# Altium schematic sheet MCU.SchDoc
size A4; SheetNumber: 2; SheetTotal: 4
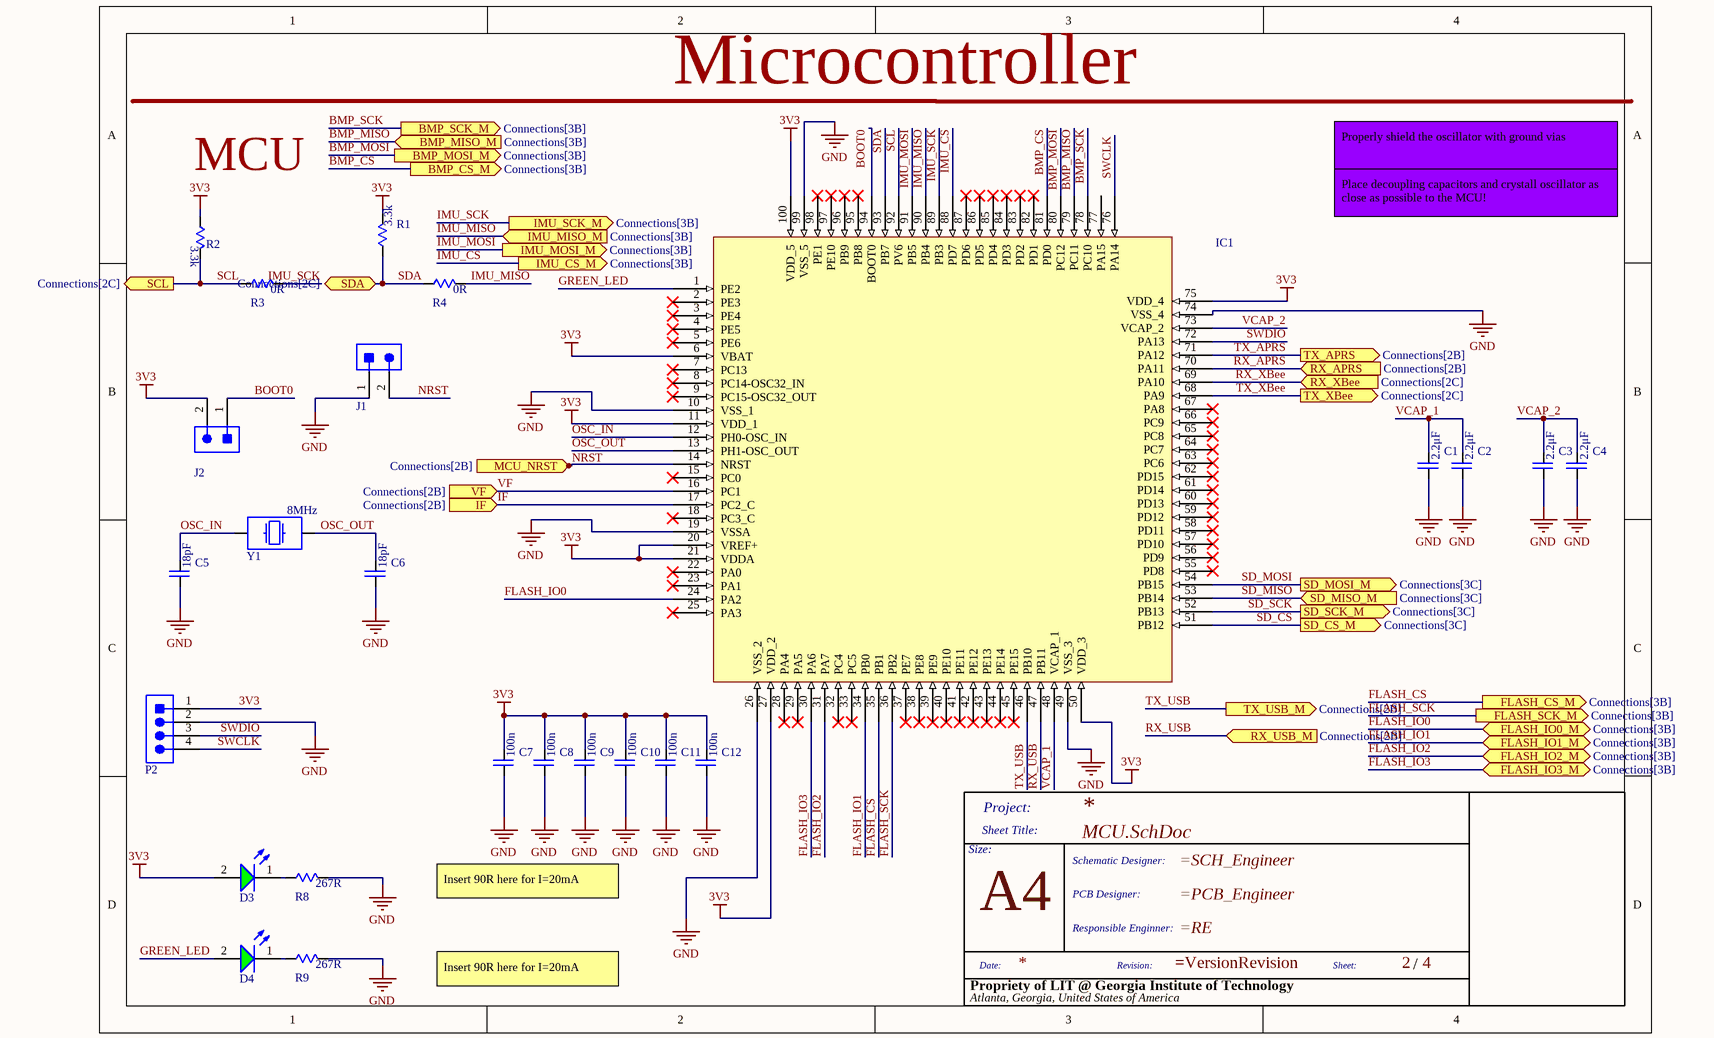
[diagram p0: MCU.SchDoc]

## Parts
*  Size: A4  (hidden comment: TitleBlock)  (graphical)
C1  CL10A225KO8NNNC  [0603-CAP]  (value not drawn)
C2  CL10A225KO8NNNC  [0603-CAP]  (value not drawn)
C3  CL10A225KO8NNNC  [0603-CAP]  (value not drawn)
C4  CL10A225KO8NNNC  [0603-CAP]  (value not drawn)
C5  600F180FT250XT  [CAP-0805]  (value not drawn)
C6  600F180FT250XT  [CAP-0805]  (value not drawn)
C7  KGM21NR71E104KT  [CAP-0805]  (value not drawn)
C8  KGM21NR71E104KT  [CAP-0805]  (value not drawn)
C9  KGM21NR71E104KT  [CAP-0805]  (value not drawn)
C10  KGM21NR71E104KT  [CAP-0805]  (value not drawn)
C11  KGM21NR71E104KT  [CAP-0805]  (value not drawn)
C12  KGM21NR71E104KT  [CAP-0805]  (value not drawn)
D3  LTST-C190KGKT  [FP-LTST-C190KGKT-MFG]  (value not drawn)
D4  LTST-C190KGKT  [FP-LTST-C190KGKT-MFG]  (value not drawn)
IC1  STM32H723VGT6  [QFP50P1600X1600X160-100N]  (value not drawn)
J1  61300211121  [HEADER-2-Pin]  (value not drawn)
J2  61300211121  [HEADER-2-Pin]  (value not drawn)
P2  22-27-2041  [MOLX-22-27-2041_V]  (value not drawn)
R1  ERA-3AEB332V  [0603-RES]  (value not drawn)
R2  ERA-3AEB332V  [0603-RES]  (value not drawn)
R3  ERJ-6GEY0R00V  [0805-RES]  (value not drawn)
R4  ERJ-6GEY0R00V  [0805-RES]  (value not drawn)
R8  ERJ-3EKF2670V  [0603-RES]  (value not drawn)
R9  ERJ-3EKF2670V  [0603-RES]  (value not drawn)
Y1  ABLS-8.000MHZ-B2-T  [ABLS-8.000MHZ-B2-T]  (value not drawn)

## Ports
BMP_CS_M (out, see Connections[3B]), BMP_MISO_M (in, see Connections[3B]), BMP_MOSI_M (out, see Connections[3B]), BMP_SCK_M (out, see Connections[3B]), FLASH_CS_M (out, see Connections[3B]), FLASH_IO0_M (bidir, see Connections[3B]), FLASH_IO1_M (bidir, see Connections[3B]), FLASH_IO2_M (bidir, see Connections[3B]), FLASH_IO3_M (bidir, see Connections[3B]), FLASH_SCK_M (out, see Connections[3B]), IF (in, see Connections[2B]), IMU_CS_M (out, see Connections[3B]), IMU_MISO_M (in, see Connections[3B]), IMU_MOSI_M (out, see Connections[3B]), IMU_SCK_M (out, see Connections[3B]), MCU_NRST (in, see Connections[2B]), RX_APRS (in, see Connections[2B]), RX_USB_M (in, see Connections[2B]), RX_XBee (in, see Connections[2C]), SCL (out, see Connections[2C]), SD_CS_M (out, see Connections[3C]), SD_MISO_M (in, see Connections[3C]), SD_MOSI_M (out, see Connections[3C]), SD_SCK_M (out, see Connections[3C]), SDA (bidir, see Connections[2C]), TX_APRS (out, see Connections[2B]), TX_USB_M (out, see Connections[2B]), TX_XBee (out, see Connections[2C]), VF (in, see Connections[2B])

## Nets
3V3: C7.2 C8.2 C9.2 C10.2 C11.2 C12.2 D3.2(A) IC1.6(VBAT) IC1.11(VDD_1) IC1.20(VREF+) IC1.21(VDDA) IC1.27(VDD_2) IC1.50(VDD_3) IC1.75(VDD_4) IC1.100(VDD_5) J2.2 P2.1 R1.2 R2.1
GND: C1.1 C2.1 C3.1 C4.1 C5.1 C6.1 C7.1 C8.1 C9.1 C10.1 C11.1 C12.1 IC1.10(VSS_1) IC1.19(VSSA) IC1.26(VSS_2) IC1.49(VSS_3) IC1.74(VSS_4) IC1.99(VSS_5) J1.1 P2.2 R8.2 R9.2
BMP_CS: IC1.81(PD0) ; port BMP_CS_M
BMP_MISO: IC1.79(PC11) ; port BMP_MISO_M
BMP_MOSI: IC1.80(PC12) ; port BMP_MOSI_M
BMP_SCK: IC1.78(PC10) ; port BMP_SCK_M
BOOT0: IC1.94(BOOT0) J2.1
FLASH_CS: IC1.35(PB1) ; port FLASH_CS_M
FLASH_IO0: IC1.24(PA2) ; port FLASH_IO0_M
FLASH_IO1: IC1.34(PB0) ; port FLASH_IO1_M
FLASH_IO2: IC1.31(PA7) ; port FLASH_IO2_M
FLASH_IO3: IC1.30(PA6) ; port FLASH_IO3_M
FLASH_SCK: IC1.36(PB2) ; port FLASH_SCK_M
GREEN_LED: D4.2(A) IC1.1(PE2)
IF: IC1.17(PC2_C) ; port IF
IMU_CS: IC1.88(PD7) ; port IMU_CS_M
IMU_MISO: IC1.90(PB4) R4.2 ; port IMU_MISO_M
IMU_MOSI: IC1.91(PB5) ; port IMU_MOSI_M
IMU_SCK: IC1.89(PB3) R3.2 ; port IMU_SCK_M
NRST: IC1.14(NRST) J1.2 ; port MCU_NRST
OSC_IN: C5.2 IC1.12(PH0-OSC_IN) Y1.1
OSC_OUT: C6.2 IC1.13(PH1-OSC_OUT) Y1.2
RX_APRS: IC1.70(PA11) ; port RX_APRS
RX_USB: IC1.47(PB11) ; port RX_USB_M
RX_XBee: IC1.69(PA10) ; port RX_XBee
SCL: IC1.92(PV6) R2.2 R3.1 ; port SCL
SD_CS: IC1.51(PB12) ; port SD_CS_M
SD_MISO: IC1.53(PB14) ; port SD_MISO_M
SD_MOSI: IC1.54(PB15) ; port SD_MOSI_M
SD_SCK: IC1.52(PB13) ; port SD_SCK_M
SDA: IC1.93(PB7) R1.1 R4.1 ; port SDA
SWCLK: IC1.76(PA14) P2.4
SWDIO: IC1.72(PA13) P2.3
TX_APRS: IC1.71(PA12) ; port TX_APRS
TX_USB: IC1.46(PB10) ; port TX_USB_M
TX_XBee: IC1.68(PA9) ; port TX_XBee
VCAP_1: C1.2 C2.2 IC1.48(VCAP_1)
VCAP_2: C3.2 C4.2 IC1.73(VCAP_2)
VF: IC1.16(PC1) ; port VF
NetD3_1: D3.1(K) R8.1
NetD4_1: D4.1(K) R9.1

Not connected (* = marked no-connect by the designer): IC1 2(PE3)* 3(PE4)* 4(PE5)* 5(PE6)* 7(PC13)* 8(PC14-OSC32_IN)* 9(PC15-OSC32_OUT)* 15(PC0)* 18(PC3_C)* 22(PA0)* 23(PA1)* 25(PA3)* 28(PA4)* 29(PA5)* 32(PC4)* 33(PC5)* 37(PE7)* 38(PE8)* 39(PE9)* 40(PE10)* 41(PE11)* 42(PE12)* 43(PE13)* 44(PE14)* 45(PE15)* 55(PD8)* 56(PD9)* 57(PD10)* 58(PD11)* 59(PD12)* 60(PD13)* 61(PD14)* 62(PD15)* 63(PC6)* 64(PC7)* 65(PC8)* 66(PC9)* 67(PA8)* 77(PA15) 82(PD1)* 83(PD2)* 84(PD3)* 85(PD4)* 86(PD5)* 87(PD6)* 95(PB8)* 96(PB9)* 97(PE10)* 98(PE1)*

## Notes on the sheet
- Microcontroller
- (near R2) MCU
- Properly shield the oscillator with ground vias
- Place decoupling capacitors and crystall oscillator as close as possible to the MCU!
- Insert 90R here for I=20mA
- (in symbol CAP-0603-16V) 2.2μF
- (in symbol CAP-0805-25V-100n) 100n
- (in symbol CAP-0805-250V-18pF) 18pF
- (in symbol OSC-8MHz-3V3) 8MHz
- (in symbol RES-0603-3.3k) 3.3k
- (in symbol RES-0603-267R) 267R
- (in symbol RES-0805-0R) 0R
- (in symbol TitleBlock) Project:; Sheet Title:; Size:; Schematic Designer:; PCB Designer:; Responsible Enginner:; Date:; Revision:; Sheet:; /; Propriety of LIT @ Georgia Institute of Technology; Atlanta, Georgia, United States of America

## Library data of the parts
* = TitleBlock: Standard Title Block
C1-C4 = CAP-0603-16V: 2.2 µF ±10% 16V Ceramic Capacitor X5R 0603 (1608 Metric); Manufacturer: Samsung Electro-Mechanics; Part number: CL10A225KO8NNNC
C5 C6 = CAP-0805-250V-18pF: 18 pF ±1% 250V Ceramic Capacitor C0G, NP0 0805 (2012 Metric)
C7-C12 = CAP-0805-25V-100n: 0.1 µF ±10% 25V Ceramic Capacitor X7R 0805 (2012 Metric)
D3 D4 = LED-0603-Green_: Green 571nm LED Indication - Discrete 2V 0603 (1608 Metric)
IC1 = STMH723VGT6: ARM® Cortex®-M7 STM32H7 Microcontroller IC 32-Bit Single-Core 550MHz 1MB (1M x 8) FLASH 100-LQFP (14x14); Manufacturer: STMicroelectronics; Part number: STM32H723VGT6
J1 J2 = Header-2-Pin-Male: Connector Header Through Hole 2 position 0.100" (2.54mm); Manufacturer: Würth Elektronik; Part number: 61300211121
P2 = Header-4-Pin: Male Header, Pitch 2.54 mm, 1 x 4 Position, Height 11.7 mm, Tail Length 3.56 mm, RoHS, Bulk; Manufacturer: MOLEX; Part number: 22-27-2041
R1 R2 = RES-0603-3.3k: 3.3 kOhms ±0.1% 0.1W, 1/10W Chip Resistor 0603 (1608 Metric) Automotive AEC-Q200 Thin Film; Manufacturer: Panasonic Electronic Components; Part number: ERA-3AEB332V
R3 R4 = RES-0805-0R: 0 Ohms Jumper Chip Resistor 0805 (2012 Metric) Automotive AEC-Q200 Thick Film
R8 R9 = RES-0603-267R: 267 Ohms ±1% 0.1W, 1/10W Chip Resistor 0603 (1608 Metric) Automotive AEC-Q200 Thick Film; Manufacturer: Panasonic Electronic Components; Part number: ERJ-3EKF2670V
Y1 = OSC-8MHz-3V3: 8 MHz ±20ppm Crystal 18pF 80 Ohms HC-49/US